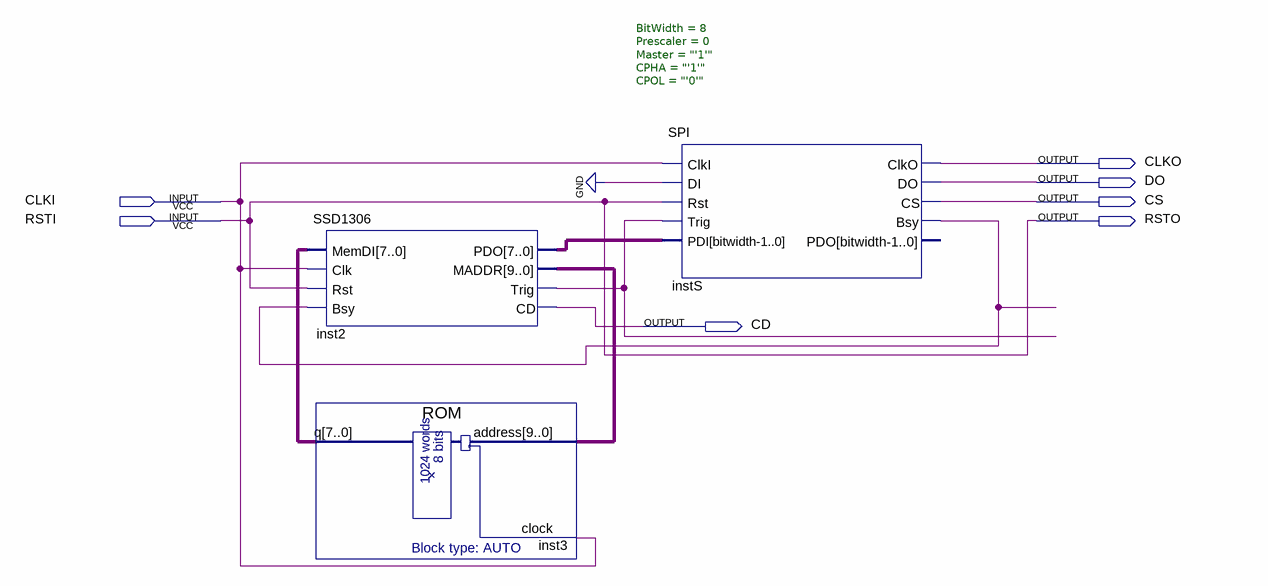
[diagram p0: schematic sheet]
// Quartus schematic SSD1306_VHDLImplementation.bdf as structural Verilog: 3 symbols, 7 pins
module SSD1306_VHDLImplementation (
  input  CLKI,
  input  RSTI,
  output CLKO,
  output DO,
  output CS,
  output RSTO,
  output CD
);

  wire inst2_trig, instS_bsy;
  wire [7:0] inst2_pdo, inst3_q;
  wire [9:0] inst2_maddr;

  SSD1306 inst2 (
    .MemDI(inst3_q), .Clk(CLKI), .Rst(RSTI), .Bsy(instS_bsy), .PDO(inst2_pdo), .MADDR(inst2_maddr),
    .Trig(inst2_trig), .CD(CD));
  ROM inst3 (.address(inst2_maddr), .clock(CLKI), .q(inst3_q));
  SPI #(.BitWidth(8), .Prescaler(0), .Master("'1'"), .CPHA("'1'"), .CPOL("'0'")) instS (
    .ClkI(CLKI), .DI(1'b0), .Rst(RSTI), .Trig(inst2_trig), .PDI(inst2_pdo), .ClkO(CLKO), .DO(DO), .CS(CS),
    .Bsy(instS_bsy));  // open: PDO

  assign RSTO = RSTI;
endmodule
